# Altium schematic sheet MinibalanceV5.0模块化小车主板.SchDoc
size A4
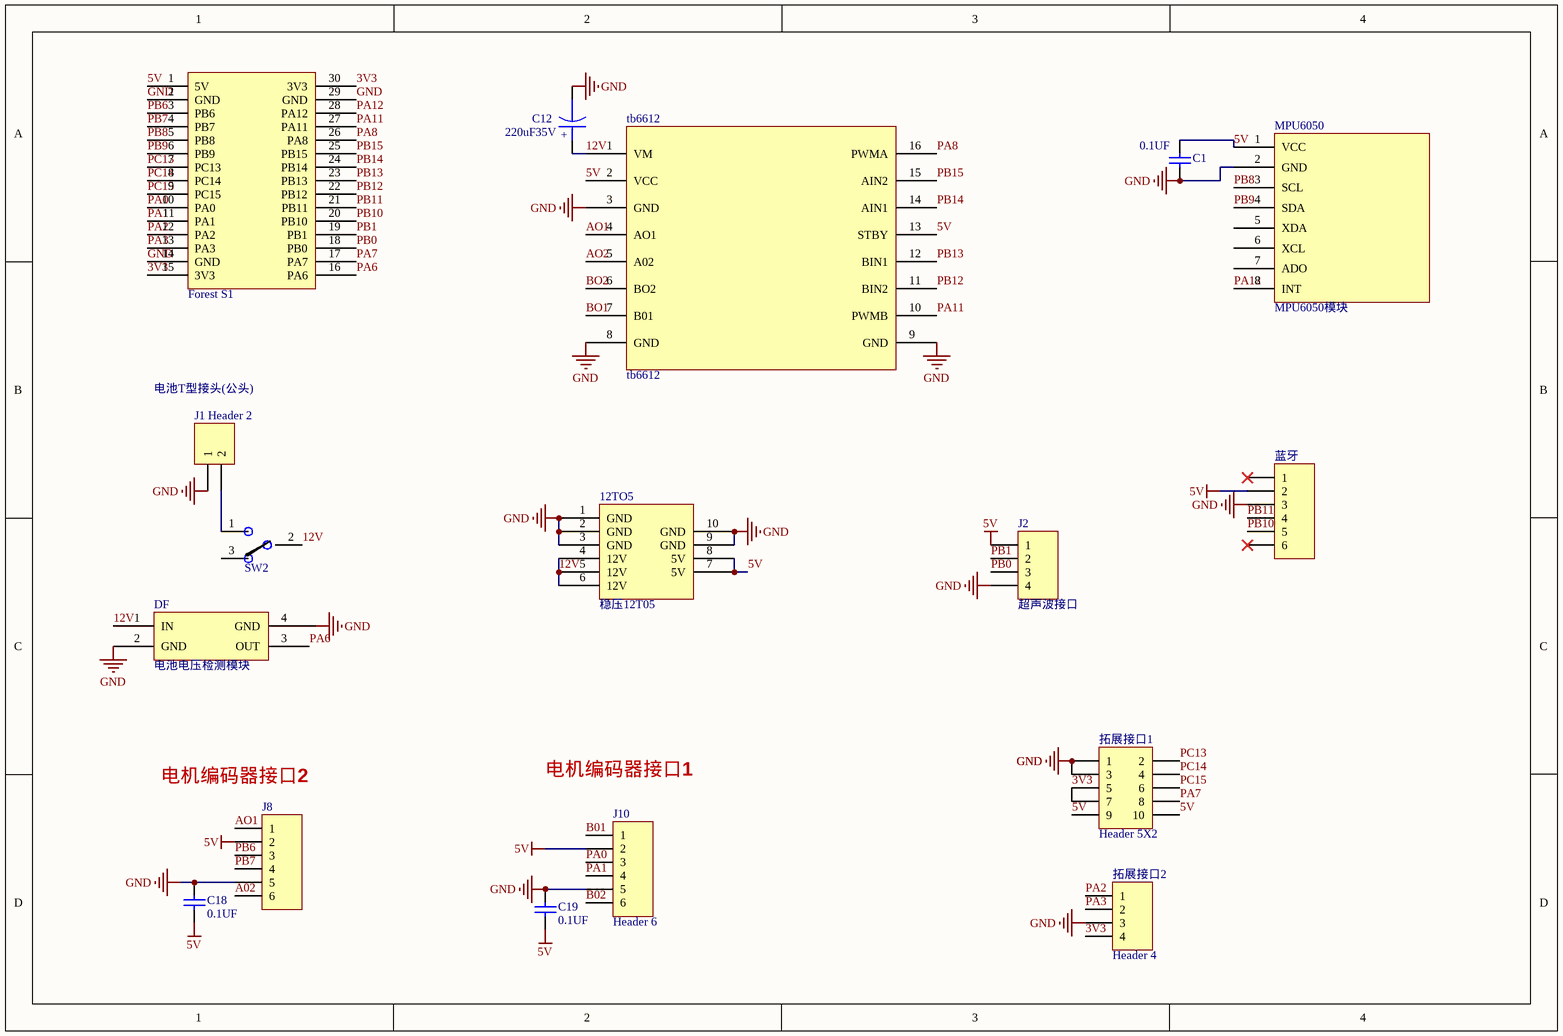
[diagram p0: MinibalanceV5.0模块化小车主板.SchDoc]

## Parts
12TO5  稳压12T05  [稳压12T05]
?  Forest S1  [Forest S1 keepout]
C1  value 0.1UF  [Cap-CP]
C12  220uF35V  [CAP-820uF-6.3V]
C18  value 0.1UF  [Cap-CP]
C19  value 0.1UF  [Cap-CP]
DF  电池电压检测模块  [DF]
J1  Header 2  [T HEAD]
J2  超声波接口  [HDR1X4]
J8  (no value)  [HDR1X6 - XH直]
J10  Header 6  [HDR1X6 - XH直]
MPU6050  MPU6050模块  [6050new]
SW2  SW-SPDT  [SS12d11拨动电源开关]  (value not drawn)
tb6612  tb6612  [TB6612DIP]
拓展接口1  Header 5X2  [HDR2X5]
拓展接口2  Header 4  [HDR1X4]
蓝牙  (no value)  [1*6弯排母]

## Nets
5V: 12TO5.7(5V) 12TO5.8(5V) ?.1(5V) C1.2 C18.2 C19.2 J2.1 J8.2 J10.2 MPU6050.1(VCC) tb6612.2(VCC) tb6612.13(STBY) 拓展接口1.9 拓展接口1.10 蓝牙.2
GND: 12TO5.1(GND) 12TO5.2(GND) 12TO5.3(GND) 12TO5.9(GND) 12TO5.10(GND) ?.2(GND) ?.14(GND) ?.29(GND) C1.1 C12.2 C18.1 C19.1 DF.2(GND) J1.1 J2.4 J8.5 J10.5 MPU6050.2(GND) tb6612.3(GND) tb6612.8(GND) tb6612.9(GND) 拓展接口1.1 拓展接口2.3 蓝牙.3
3V3: ?.15(3V3) ?.30(3V3) 拓展接口1.5 拓展接口2.4
12V: 12TO5.4(12V) 12TO5.5(12V) 12TO5.6(12V) C12.1 DF.1(IN) SW2.2 tb6612.1(VM)
A02: J8.6
AO1: J8.1 tb6612.4(AO1)
AO2: tb6612.5(A02)
B01: J10.1
B02: J10.6
BO1: tb6612.7(B01)
BO2: tb6612.6(BO2)
PA0: ?.10(PA0) J10.3
PA1: ?.11(PA1) J10.4
PA2: ?.12(PA2) 拓展接口2.1
PA3: ?.13(PA3) 拓展接口2.2
PA6: ?.16(PA6) DF.3(OUT)
PA7: ?.17(PA7) 拓展接口1.8
PA8: ?.26(PA8) tb6612.16(PWMA)
PA11: ?.27(PA11) tb6612.10(PWMB)
PA12: ?.28(PA12) MPU6050.8(INT)
PB0: ?.18(PB0) J2.3
PB1: ?.19(PB1) J2.2
PB6: ?.3(PB6) J8.3
PB7: ?.4(PB7) J8.4
PB8: ?.5(PB8) MPU6050.3(SCL)
PB9: ?.6(PB9) MPU6050.4(SDA)
PB10: ?.20(PB10) 蓝牙.5
PB11: ?.21(PB11) 蓝牙.4
PB12: ?.22(PB12) tb6612.11(BIN2)
PB13: ?.23(PB13) tb6612.12(BIN1)
PB14: ?.24(PB14) tb6612.14(AIN1)
PB15: ?.25(PB15) tb6612.15(AIN2)
PC13: ?.7(PC13) 拓展接口1.2
PC14: ?.8(PC14) 拓展接口1.4
PC15: ?.9(PC15) 拓展接口1.6
NetJ1_2: J1.2 SW2.1

Not connected (* = marked no-connect by the designer): DF 4(GND); MPU6050 5(XDA) 6(XCL) 7(ADO); SW2 3; 拓展接口1 3 7; 蓝牙 1* 6*

## Notes on the sheet
- 电池T型接头(公头)
- (near J8) 电机编码器接口2
- 电机编码器接口1
- Labels drawn without touching a wire or pin: GND
- (in symbol CAPACITOR POL) +

## Library data of the parts
C1 C18 C19 = Cap: Capacitor; Published: 8-Jun-2000; LatestRevisionDate: 17-Jul-2002; LatestRevisionNote: Re-released for DXP Platform.; PackageReference: RAD-0.3; Publisher: Altium Limited
  C1: PackageDescription: Radial Cap, Thru-Hole; 2 Leads; 0.3 in Pin Spacing
C12 = CAPACITOR POL: Capacitor
DF = 电阻分压测量电量
J1 = Header 2: Header, 2-Pin; LatestRevisionDate: 17-Jul-2002; LatestRevisionNote: Re-released for DXP Platform.; Publisher: Altium Limited
J2 拓展接口2 = Header 4: Header, 4-Pin; LatestRevisionDate: 17-Jul-2002; LatestRevisionNote: Re-released for DXP Platform.; Publisher: Altium Limited
J8 J10 蓝牙 = Header 6: 不用焊; LatestRevisionDate: 17-Jul-2002; LatestRevisionNote: Re-released for DXP Platform.; Publisher: Altium Limited
SW2 = SW-SPDT: 单刀双掷开关
拓展接口1 = Header 5X2: Header, 5-Pin, Dual row; LatestRevisionDate: 17-Jul-2002; LatestRevisionNote: Re-released for DXP Platform.; Publisher: Altium Limited